# EAGLE design robot_driver_board (EAGLE 9.0.0)
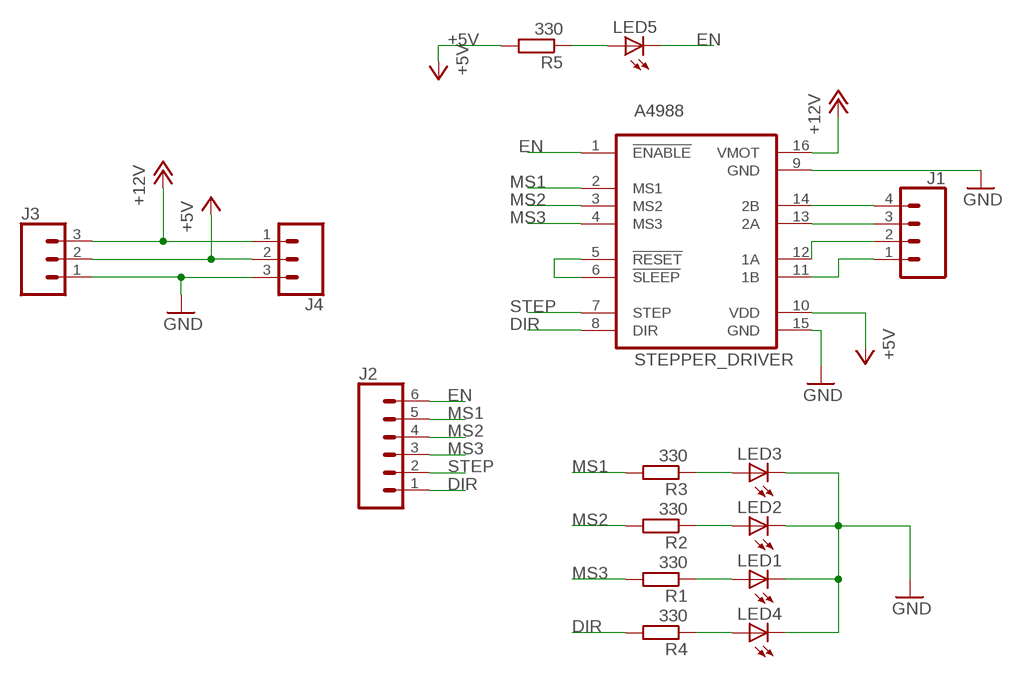
[diagram p0: schematic, sheet 1]

## Parts
J1  CONN_04POLAR  [MOLEX-1X4]
J2  CONN_06POLAR  [MOLEX-1X6]
J3  CONN_03-SCREW-5MM  [SCREWTERMINAL-5MM-3]
J4  CONN_03-SCREW-5MM  [SCREWTERMINAL-5MM-3]
LED1  LED3MM  [LED3MM]
LED2  LED3MM  [LED3MM]
LED3  LED3MM  [LED3MM]
LED4  LED3MM  [LED3MM]
LED5  LED3MM  [LED3MM]
R1  330  R-EU_0207/10  [0207/10]
R2  330  R-EU_0204/7  [0204/7]
R3  330  R-EU_0204/7  [0204/7]
R4  330  R-EU_0204/7  [0204/7]
R5  330  R-EU_0204/7  [0204/7]
STEPPER_DRIVER  A4988  POLOLULU2128  [POLOLULU2128]

## Nets
+5V: J3.2 J4.2 R5.2 STEPPER_DRIVER.10(VDD)
+12V: J3.3 J4.1 STEPPER_DRIVER.16(VMOT)
DIR: J2.1 R4.2 STEPPER_DRIVER.8(DIR)
EN: J2.6 LED5.K(C) STEPPER_DRIVER.1(!ENABLE)
GND: J3.1 J4.3 LED1.K(C) LED2.K(C) LED3.K(C) LED4.K(C) STEPPER_DRIVER.9(GND) STEPPER_DRIVER.15(GND)
MS1: J2.5 R3.2 STEPPER_DRIVER.2(MS1)
MS2: J2.4 R2.2 STEPPER_DRIVER.3(MS2)
MS3: J2.3 R1.2 STEPPER_DRIVER.4(MS3)
N$1: J1.4 STEPPER_DRIVER.14(2B)
N$2: J1.3 STEPPER_DRIVER.13(2A)
N$3: J1.2 STEPPER_DRIVER.12(1A)
N$4: STEPPER_DRIVER.5(!RESET) STEPPER_DRIVER.6(!SLEEP)
N$5: J1.1 STEPPER_DRIVER.11(1B)
N$6: LED1.A R1.1
N$7: LED2.A R2.1
N$8: LED3.A R3.1
N$9: LED4.A R4.1
N$10: LED5.A R5.1
STEP: J2.2 STEPPER_DRIVER.7(STEP)

## Library data of the parts
J1 = SparkFun-Connectors:CONN_04: Multi connection point. Often used as Generic Header-pin footprint for 0.1 inch spaced/style header connections On any of the 0.1 inch spaced packages, you can populate with these: Break Away Headers - Straight <https://www.sparkfun.com/products/116> (PRT-00116) Break Away Male Headers - Right Angle <https://www.sparkfun.com/products/553> (PRT-00553) Female Headers <https://www.sparkfun.com/products/115> (PRT-00115) Break Away Headers - Machine Pin <https://www.sparkfun.com/products/117> (PRT-00117) Break Away Female Headers - Swiss Machine Pin <https://www.sparkfun.com/products/743> (PRT-00743) For SCREWTERMINALS and SPRING TERMINALS visit here: Screw Terimnals on SparkFun.com <https://www.sparkfun.com/search/results?term=Screw+Terminals> (5mm/3.5mm/2.54mm spacing) This device is also useful as a general connection point to wire up your design to another part of your project. Our various solder wires solder well into these plated through hole pads. Hook-Up Wire - Assortment (Stranded, 22 AWG) <https://www.sparkfun.com/products/11375> (PRT-11375) Hook-Up Wire - Assortment (Solid Core, 22 AWG) <https://www.sparkfun.com/products/11367> (PRT-11367) View the entire wire category on our website here <https://www.sparkfun.com/categories/141> Special notes: Molex polarized connector foot print use with SKU : PRT-08231 with associated crimp pins and housings. 1MM SMD Version SKU: PRT-10208; PROD_ID: CONN-08186; SF_ID: PRT-08231
J2 = SparkFun-Connectors:CONN_06: Multi connection point. Often used as Generic Header-pin footprint for 0.1 inch spaced/style header connections On any of the 0.1 inch spaced packages, you can populate with these: Break Away Headers - Straight <https://www.sparkfun.com/products/116> (PRT-00116) Break Away Male Headers - Right Angle <https://www.sparkfun.com/products/553> (PRT-00553) Female Headers <https://www.sparkfun.com/products/115> (PRT-00115) Break Away Headers - Machine Pin <https://www.sparkfun.com/products/117> (PRT-00117) Break Away Female Headers - Swiss Machine Pin <https://www.sparkfun.com/products/743> (PRT-00743) Arduino Stackable Header - 6 Pin <https://www.sparkfun.com/products/9280> (PRT-09280) For SCREWTERMINALS and SPRING TERMINALS visit here: Screw Terimnals on SparkFun.com <https://www.sparkfun.com/search/results?term=Screw+Terminals> (5mm/3.5mm/2.54mm spacing) This device is also useful as a general connection point to wire up your design to another part of your project. Our various solder wires solder well into these plated through hole pads. Hook-Up Wire - Assortment (Stranded, 22 AWG) <https://www.sparkfun.com/products/11375> (PRT-11375) Hook-Up Wire - Assortment (Solid Core, 22 AWG) <https://www.sparkfun.com/products/11367> (PRT-11367) View the entire wire category on our website here <https://www.sparkfun.com/categories/141>
J3 J4 = SparkFun-Connectors:CONN_03: Multi connection point. Often used as Generic Header-pin footprint for 0.1 inch spaced/style header connections On any of the 0.1 inch spaced packages, you can populate with these: Break Away Headers - Straight <https://www.sparkfun.com/products/116> (PRT-00116) Break Away Male Headers - Right Angle <https://www.sparkfun.com/products/553> (PRT-00553) Female Headers <https://www.sparkfun.com/products/115> (PRT-00115) Break Away Headers - Machine Pin <https://www.sparkfun.com/products/117> (PRT-00117) Break Away Female Headers - Swiss Machine Pin <https://www.sparkfun.com/products/743> (PRT-00743) Stackable Header - 3 Pin (Female, 0.1") <https://www.sparkfun.com/products/13875> (PRT-13875) For SCREWTERMINALS and SPRING TERMINALS visit here: Screw Terimnals on SparkFun.com <https://www.sparkfun.com/search/results?term=Screw+Terminals> (5mm/3.5mm/2.54mm spacing) This device is also useful as a general connection point to wire up your design to another part of your project. Our various solder wires solder well into these plated through hole pads. Hook-Up Wire - Assortment (Stranded, 22 AWG) <https://www.sparkfun.com/products/11375> (PRT-11375) Hook-Up Wire - Assortment (Solid Core, 22 AWG) <https://www.sparkfun.com/products/11367> (PRT-11367) View the entire wire category on our website here <https://www.sparkfun.com/categories/141> Special notes: Molex polarized connector foot print use with SKU : PRT-08232 with associated crimp pins and housings.; PROD_ID: CONN-10134; SF_SKU: PRT-08433
LED1-LED5 = led:LED: LED OSRAM: - CHIPLED LG R971, LG N971, LY N971, LG Q971, LY Q971, LO R971, LY R971 LH N974, LH R974 LS Q976, LO Q976, LY Q976 LO Q996 - Hyper CHIPLED LW Q18S LB Q993, LB Q99A, LB R99A - SideLED LS A670, LO A670, LY A670, LG A670, LP A670 LB A673, LV A673, LT A673, LW A673 LH A674 LY A675 LS A676, LA A676, LO A676, LY A676, LW A676 LS A679, LY A679, LG A679 - Hyper Micro SIDELED® LS Y876, LA Y876, LO Y876, LY Y876 LT Y87S - SmartLED LW L88C, LW L88S LB L89C, LB L89S, LG L890 LS L89K, LO L89K, LY L89K LS L896, LA L896, LO L896, LY L896 - TOPLED LS T670, LO T670, LY T670, LG T670, LP T670 LSG T670, LSP T670, LSY T670, LOP T670, LYG T670 LG T671, LOG T671, LSG T671 LB T673, LV T673, LT T673, LW T673 LH T674 LS T676, LA T676, LO T676, LY T676, LB T676, LH T676, LSB T676, LW T676 LB T67C, LV T67C, LT T67C, LS T67K, LO T67K, LY T67K, LW E67C LS E67B, LA E67B, LO E67B, LY E67B, LB E67C, LV E67C, LT E67C LW T67C LS T679, LY T679, LG T679 LS T770, LO T770, LY T770, LG T770, LP T770 LB T773, LV T773, LT T773, LW T773 LH T774 LS E675, LA E675, LY E675, LS T675 LS T776, LA T776, LO T776, LY T776, LB T776 LHGB T686 LT T68C, LB T68C - Hyper Mini TOPLED® LB M676 - Mini TOPLED Santana® LG M470 LS M47K, LO M47K, LY M47K Source: http://www.osram.convergy.de LUXEON: - LUMILED® LXK2-PW12-R00, LXK2-PW12-S00, LXK2-PW14-U00, LXK2-PW14-V00 LXK2-PM12-R00, LXK2-PM12-S00, LXK2-PM14-U00 LXK2-PE12-Q00, LXK2-PE12-R00, LXK2-PE12-S00, LXK2-PE14-T00, LXK2-PE14-U00 LXK2-PB12-K00, LXK2-PB12-L00, LXK2-PB12-M00, LXK2-PB14-N00, LXK2-PB14-P00, LXK2-PB14-Q00 LXK2-PR12-L00, LXK2-PR12-M00, LXK2-PR14-Q00, LXK2-PR14-R00 LXK2-PD12-Q00, LXK2-PD12-R00, LXK2-PD12-S00 LXK2-PH12-R00, LXK2-PH12-S00 LXK2-PL12-P00, LXK2-PL12-Q00, LXK2-PL12-R00 Source: www.luxeon.com KINGBRIGHT: KA-3528ASYC Source: www.kingbright.com
R1-R5 = resistor:R-EU_: RESISTOR, European symbol
STEPPER_DRIVER = stepper_drivers_etc:POLOLULU2128

## Board
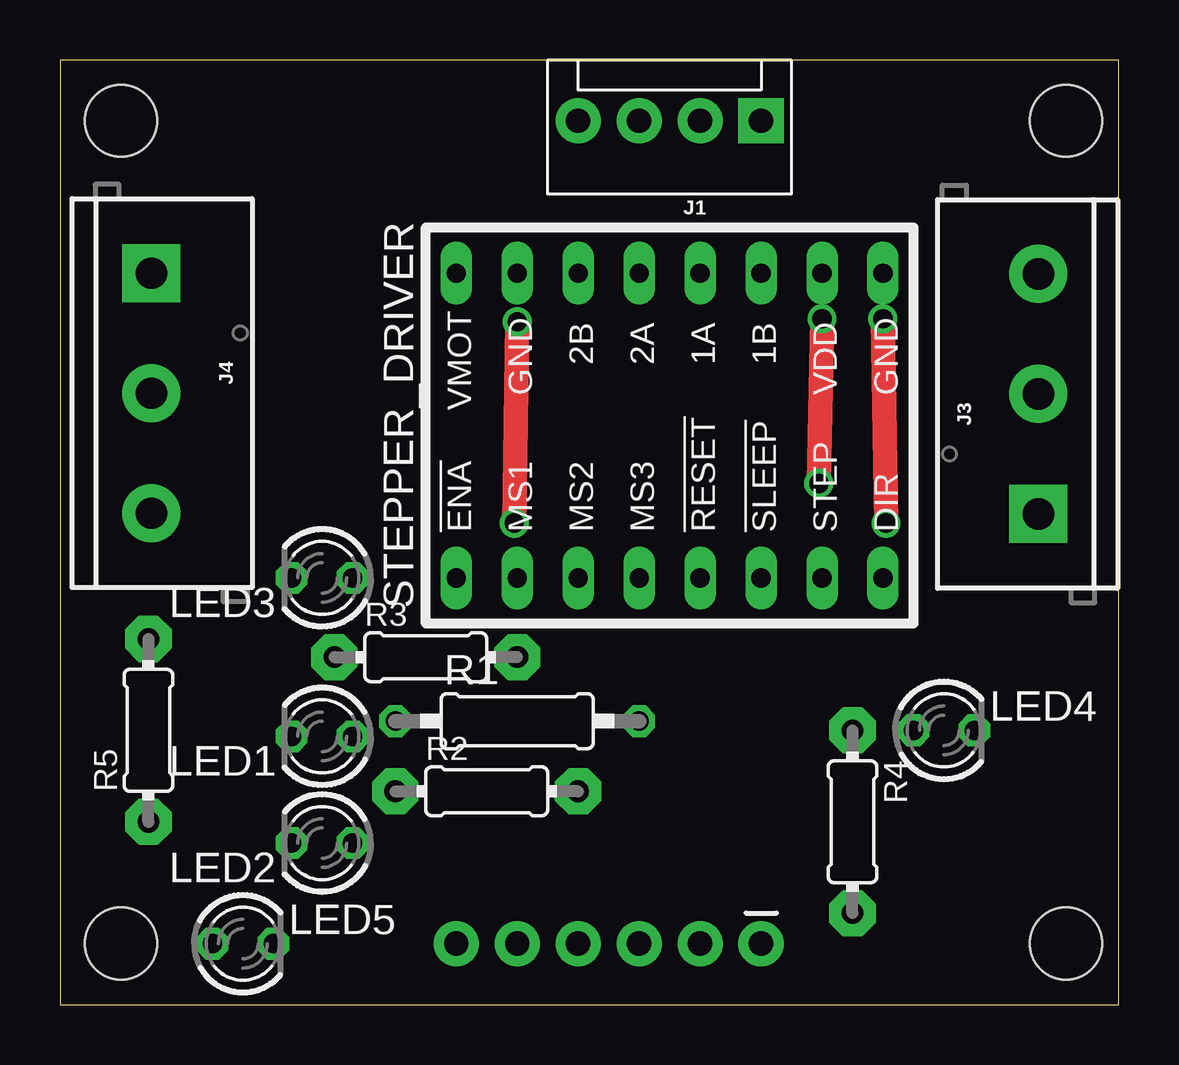
[diagram p1: board, top side]
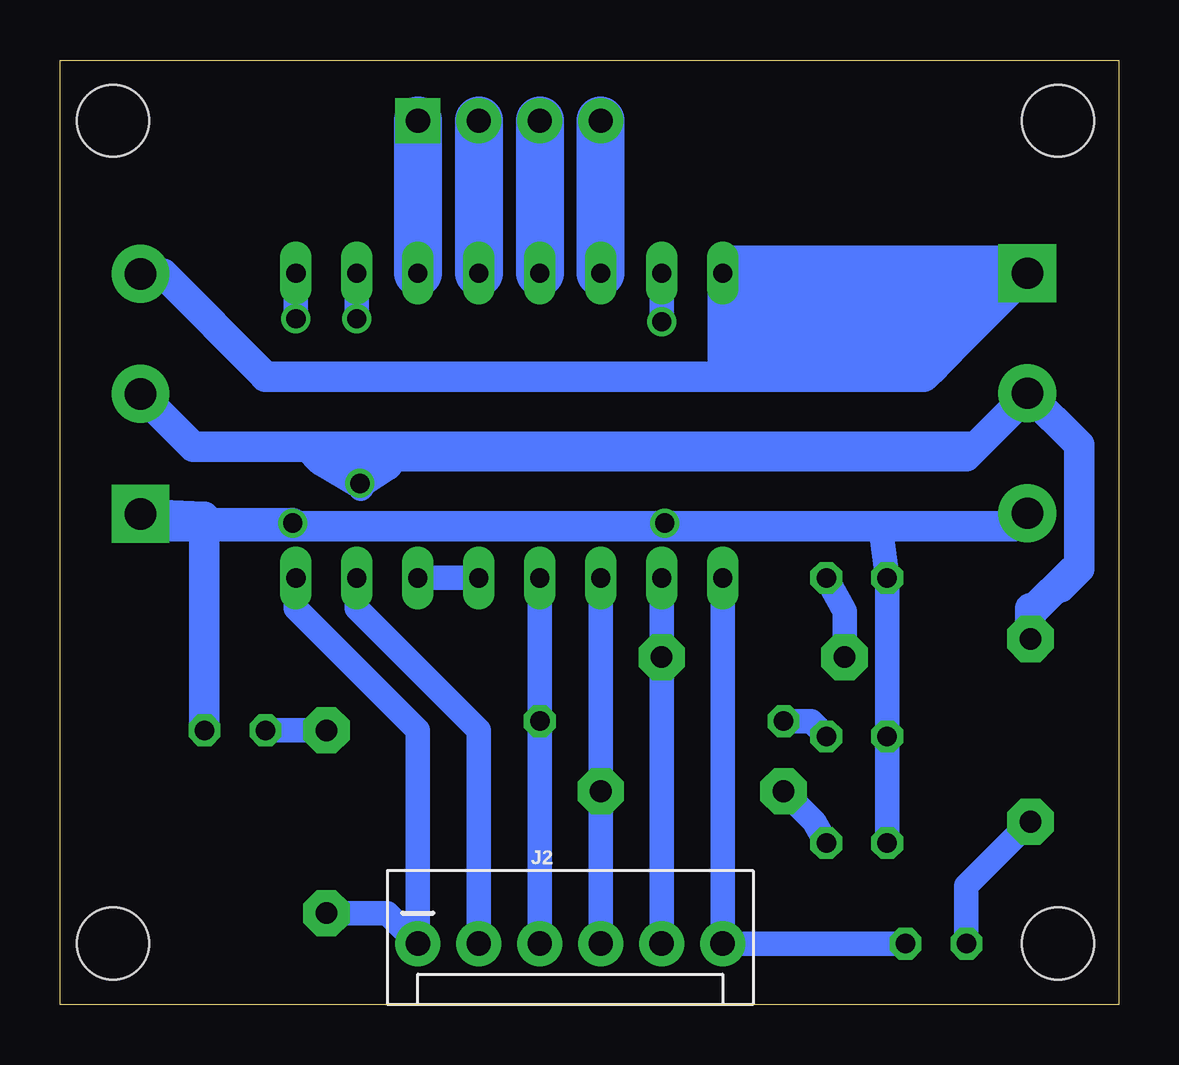
[diagram p2: board, bottom side, seen from below]

Size 44.12 x 39.36 mm. Coordinates in mm from the lower left corner, seen from the top.
Outline: 0,0 44.12,0 44.12,39.36 0,39.36 0,0
Copper layers (1*16): Top 0.035mm / dielectric 1.5mm / Bottom 0.035mm
Design rules "default": minimum track width 6mil, minimum drill 0.35mm, track to track 6mil, track to pad 6mil, pad to pad 6mil, via to via 6mil, smd to smd 6mil, copper to edge 40mil, drill to drill 6mil, minimum pad ring 10mil, minimum via ring 8mil, stop-mask expansion 4mil, vias tented up to drill 0mil, thermal gap 10mil
Holes 3 mm at 2.54,36.83 41.91,36.83 41.91,2.54 2.54,2.54

### Footprints (pad centres in the part's own frame; a part is rotated, then mirrored left to right if it is on the bottom)
MOLEX-1X4 = drill 1.016 pad 1.88 square: 1 0,0 | drill 1.016 pad 1.88: 2 2.54,0; 3 5.08,0; 4 7.62,0
MOLEX-1X6 = drill 1.016 pad 1.88: 1 0,0; 2 2.54,0; 3 5.08,0; 4 7.62,0; 5 10.16,0; 6 12.7,0
SCREWTERMINAL-5MM-3 = drill 1.3 pad 2.413 square: 1 0,0 | drill 1.3 pad 2.413: 2 5,0; 3 10,0
LED3MM = drill 0.813 octagon: A -1.27,0; K 1.27,0
0207/10 = drill 0.813 octagon: 1 -5.08,0; 2 5.08,0
0204/7 = drill 0.9 pad 1.93 octagon: 1 -3.81,0; 2 3.81,0
POLOLULU2128 = drill 0.8 long: 1 -7.62,7.62; 2 -7.62,5.08; 3 -7.62,2.54; 4 -7.62,0; 5 -7.62,-2.54; 6 -7.62,-5.08; 7 -7.62,-7.62; 8 -7.62,-10.16; 9 5.08,-10.16; 10 5.08,-7.62; 11 5.08,-5.08; 12 5.08,-2.54; 13 5.08,0; 14 5.08,2.54; 15 5.08,5.08; 16 5.08,7.62

### Placement (x,y rotation side)
J1  29.21,36.83 180 top
J2  29.21,2.54 0 bottom
J3  40.77,20.45 90 top
J4  3.81,30.48 270 top
LED1  10.92,11.18 180 top
LED2  10.92,6.73 180 top
LED3  10.92,17.78 180 top
LED4  36.83,11.43 0 top
LED5  7.62,2.54 0 top
R1  19.05,11.81 0 top
R2  17.78,8.89 0 top
R3  15.24,14.48 0 top
R4  33.02,7.62 270 top
R5  3.68,11.43 90 top
STEPPER_DRIVER  24.13,25.4 90 top

### Tracks (layer width: path | path; a pad name or v marks a point on that pad's centre or on a via)
+5V  (via drill 0.8)
  Top 1.016: v31.75,28.57 v31.62,21.72
  Bottom 1.016: v31.62,21.72 31.59,21.5 31.5,21.59 | v31.75,28.57 STEPPER_DRIVER.10 | 1.65,18.16 2.03,18.16 3.68,16.51 | 3.68,16.13 2.41,17.4 | 40.68,25.36 J3.2
  Bottom 1.27: 2.41,17.4 1.65,18.16 1.65,23.32 J4.2 3.81,25.4 5.97,23.24 | 3.68,16.13 R5.2 | 3.68,16.51 R5.2 | R5.2 3.81,15.37 | 30.48,22.48 v31.62,21.72 33.21,22.67 | 30.48,22.48 30.48,22.86 6.35,22.86 5.97,23.24 | 33.78,23.24 31.24,23.24 | 31.24,23.24 30.48,22.48 | 33.21,22.67 33.78,23.24 | 33.21,22.67 33.02,22.86 31.75,22.86 | 40.68,25.36 38.56,23.24 33.78,23.24 | 31.24,23.24 5.97,23.24
+12V
  Bottom 1.27: 6.35,30.48 7.62,30.48 | 7.62,30.48 8.89,30.48 | 8.89,30.48 10.16,30.48 | 10.16,30.48 11.43,30.48 | 11.43,30.48 12.7,30.48 | 12.7,30.48 13.97,30.48 | 13.97,30.48 15.24,30.48 | 15.24,30.48 STEPPER_DRIVER.16 | 16.51,26.16 35.56,26.16 35.56,26.19 39.82,30.45 J3.3 | 16.51,26.16 15.24,26.16 | 15.24,26.16 13.97,26.16 | 13.97,26.16 12.7,26.16 | 12.7,26.16 11.43,26.16 | 11.43,26.16 10.16,26.16 | 10.16,26.16 8.89,26.16 | 8.89,26.16 8.13,26.16 7.62,26.67 | 5.08,29.21 6.35,27.94 | 6.35,27.94 7.62,26.67 | STEPPER_DRIVER.16 16.51,31.11 16.38,30.99 3.3,30.99 3.3,29.97 | STEPPER_DRIVER.16 16.51,26.16 | 15.24,30.48 15.24,26.16 | 13.97,30.48 13.97,26.16 | 12.7,30.48 12.7,26.16 | 11.43,30.48 11.43,26.16 | 10.16,30.48 10.16,26.16 | 8.89,30.48 8.89,26.16 | 7.62,30.48 7.62,26.67 | 6.35,30.48 6.35,27.94 | 6.35,30.48 5.72,29.84 | 5.72,29.84 5.08,29.21 | J4.1 4.45,29.84 | 4.45,29.84 5.08,29.21 | 5.72,29.84 4.45,29.84
DIR
  Bottom 1.016: STEPPER_DRIVER.8 34.29,16.51 29.21,11.43 J2.1 30.48,3.81 R4.2
EN
  Bottom 1.016: STEPPER_DRIVER.1 J2.6 LED5.K
GND  (via drill 0.8)
  Top 1.016: v18.92,20.07 v19.05,28.45 | v34.29,28.57 v34.42,20.07
  Bottom 1.016: 18.92,19.94 10.16,19.94 9.91,19.68 LED3.K LED1.K LED2.K | 18.92,19.94 34.42,19.94 v34.42,20.07 | v18.92,20.07 18.92,19.94 | STEPPER_DRIVER.15 v19.05,28.45 | STEPPER_DRIVER.9 v34.29,28.57 | LED4.K 38.1,19.05
  Bottom 1.27: 38.1,20.32 LED4.K | v34.42,20.07 37.85,20.07 38.1,20.32 | J4.3 4.35,19.94 8.89,19.94 10.16,19.94 40.26,19.94 J3.1 38.1,20.32
MS1
  Bottom 1.016: J2.5 R3.2 STEPPER_DRIVER.2
MS2
  Bottom 1.016: J2.4 STEPPER_DRIVER.3 R2.2
MS3
  Bottom 1.016: J2.3 STEPPER_DRIVER.4 R1.2
N$1
  Bottom 2: STEPPER_DRIVER.14 J1.4
N$2
  Bottom 2: J1.3 STEPPER_DRIVER.13
N$3
  Bottom 2: J1.2 STEPPER_DRIVER.12
N$4
  Bottom 1.016: STEPPER_DRIVER.5 STEPPER_DRIVER.6
N$5
  Bottom 2: J1.1 STEPPER_DRIVER.11
N$6
  Bottom 1.016: LED1.A 12.83,11.81 R1.1
N$7
  Bottom 1.016: R2.1 12.7,7.62 LED2.A
N$8
  Bottom 1.016: LED3.A 11.43,16.38 R3.1
N$9
  Bottom 1.016: R4.1 LED4.A
N$10
  Bottom 1.016: R5.1 6.35,4.95 LED5.A
STEP
  Bottom 1.016: J2.2 26.67,11.43 31.75,16.51 STEPPER_DRIVER.7